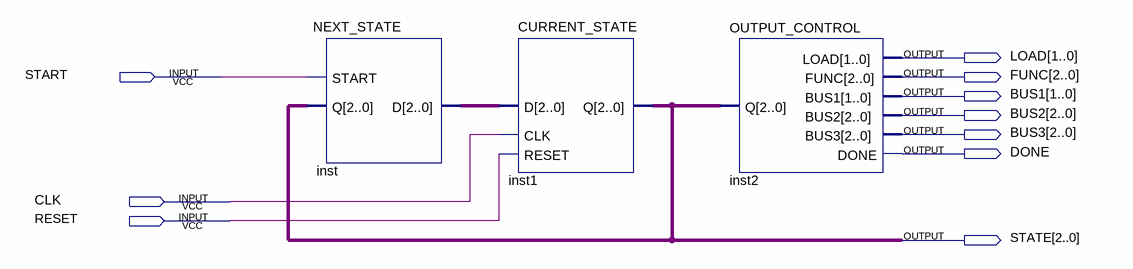
[diagram p0: schematic sheet]
// Quartus schematic CONTROLLER.bdf as structural Verilog: 3 symbols, 10 pins
module CONTROLLER (
  input  START,
  input  CLK,
  input  RESET,
  output [1:0] LOAD,
  output [2:0] FUNC,
  output [1:0] BUS1,
  output [2:0] BUS2,
  output [2:0] BUS3,
  output DONE,
  output [2:0] STATE
);

  wire [2:0] inst_d;

  NEXT_STATE inst (.Q(STATE), .START(START), .D(inst_d));
  CURRENT_STATE inst1 (.D(inst_d), .CLK(CLK), .RESET(RESET), .Q(STATE));
  OUTPUT_CONTROL inst2 (.Q(STATE), .LOAD(LOAD), .FUNC(FUNC), .BUS1(BUS1), .BUS2(BUS2), .BUS3(BUS3), .DONE(DONE));
endmodule
